# Altium project WB55_board.PrjPcb (part 2 of 3)

## Sheet MCU.SchDoc
size A4; SheetNumber: 2; SheetTotal: 3
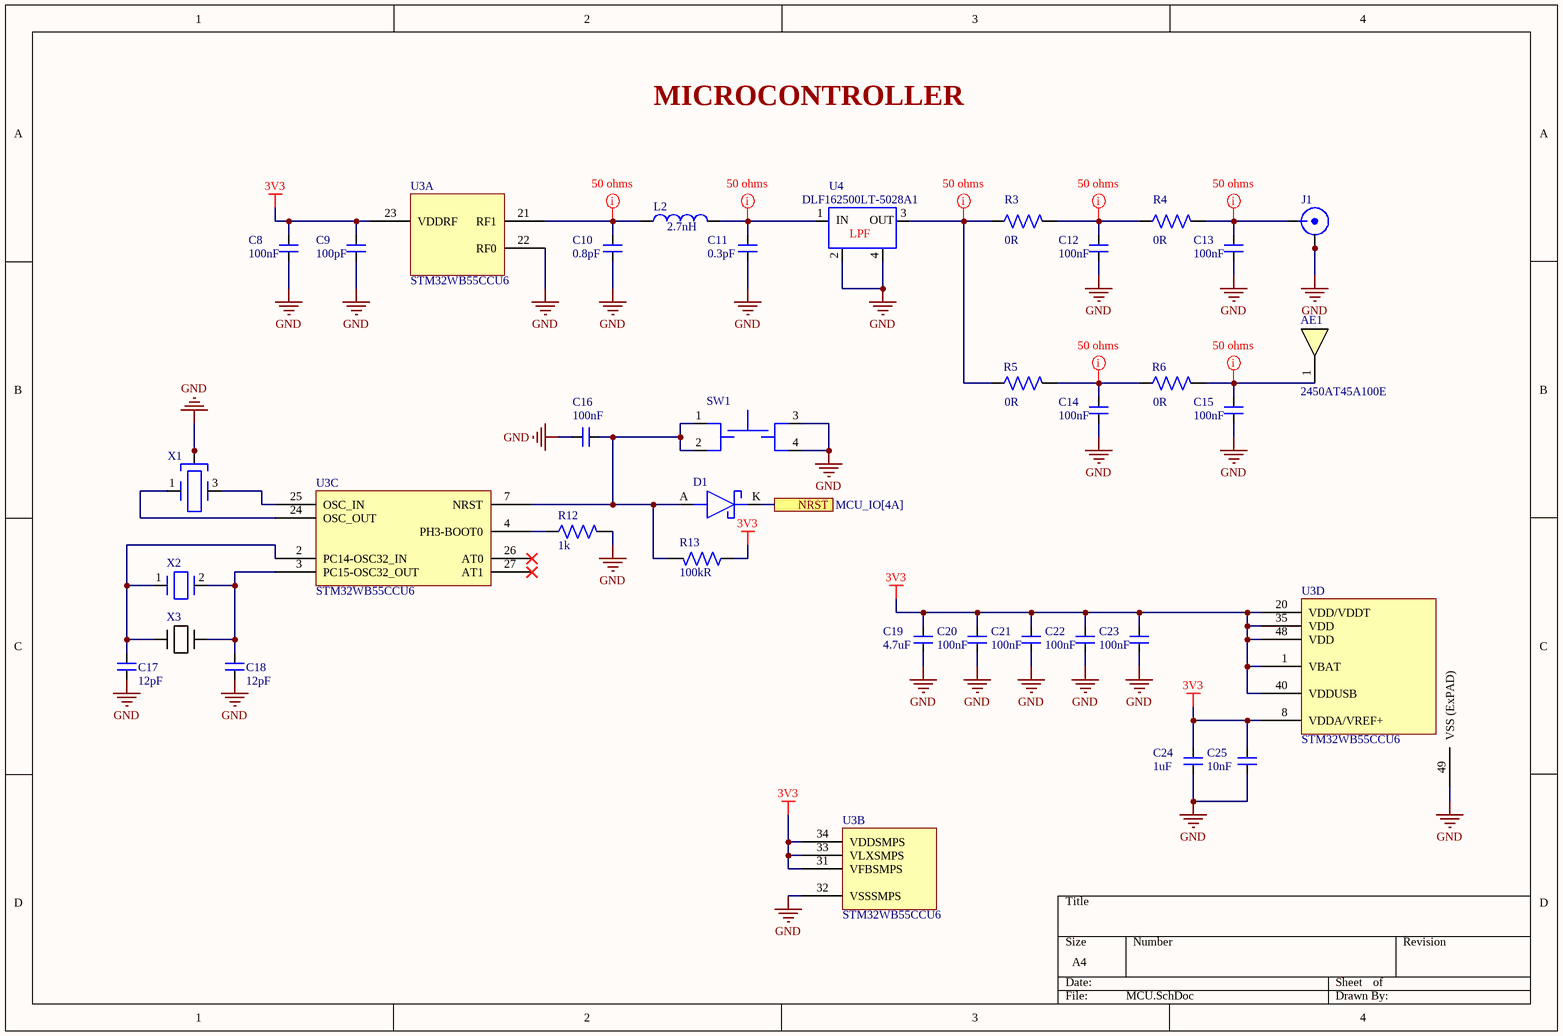
[diagram p1: MCU.SchDoc]

### Parts
AE1  2450AT45A100E  [2450AT45A100E]
C8  value 100nF  [C0402]  (hidden comment: C0402C104K4RACTU)
C9  value 100pF  [C0402]  (hidden comment: GCM1555C1H101JA16D)
C10  value 0.8pF  [C0402]  (hidden comment: GRM1555C1HR80BA01D)
C11  value 0.3pF  [C0402]  (hidden comment: GRM1555C1HR30WA01D)
C12  value 100nF  [C0402]  (hidden comment: C0402C104K4RACTU)
C13  value 100nF  [C0402]  (hidden comment: C0402C104K4RACTU)
C14  value 100nF  [C0402]  (hidden comment: C0402C104K4RACTU)
C15  value 100nF  [C0402]  (hidden comment: C0402C104K4RACTU)
C16  value 100nF  [C0402]  (hidden comment: C0402C104K4RACTU)
C17  value 12pF  [C0402]  (hidden comment: C0402C120J5GACTU)
C18  value 12pF  [C0402]  (hidden comment: C0402C120J5GACTU)
C19  value 4.7uF  [C1210]  (hidden comment: CGA6M3X7S2A475K200AB)
C20  value 100nF  [C0402]  (hidden comment: C0402C104K4RACTU)
C21  value 100nF  [C0402]  (hidden comment: C0402C104K4RACTU)
C22  value 100nF  [C0402]  (hidden comment: C0402C104K4RACTU)
C23  value 100nF  [C0402]  (hidden comment: C0402C104K4RACTU)
C24  value 1uF  [C0402]  (hidden comment: CGB2A1X6S1A105K033BC)
C25  value 10nF  [C0402]  (hidden comment: CC0402KRX7R9BB103)
D1  BAT54GWJ  [SOD123]  (value not drawn)
J1  RSP-122811-01  [U.FL-R-SMT-1(10)]  (value not drawn)
L2  LQG15HS2N7S02D  [L0402]  (value not drawn)
R3  value 0R  [R0402]  (hidden comment: RC0402JR-070RL)
R4  value 0R  [R0402]  (hidden comment: RC0402JR-070RL)
R5  value 0R  [R0402]  (hidden comment: RC0402JR-070RL)
R6  value 0R  [R0402]  (hidden comment: RC0402JR-070RL)
R12  value 1k  [R0402]  (hidden comment: RC0402FR-071KL)
R13  value 100kR  [R0402]  (hidden comment: RC0402JR-07100KL)
SW1  TS02-66-130-BK-260-LCR-D  [BUTTON]  (value not drawn)
U3  STM32WB55CCU6  [WB55]  (parts A,B,C,D of 5)
U4  DLF162500LT-5028A1  [4PIN_LPF]
X1  NX2016SA-32M-EXS00A-CS06465  [XTAL32MHZ]  (value not drawn)
X2  NX2012SA-32.768K-STD-MUB-1  [NX2012SA]  (value not drawn)
X3  ECS-.327-12.5-17X-TR  [CRI_306]  (value not drawn)

### Ports
NRST (see MCU_IO[4A])

### Nets
3V3: C8.2 C9.2 C19.2 C20.2 C21.2 C22.2 C23.2 C24.2 C25.2 R13.1 U3.1(VBAT) U3.8(VDDA/VREF+) U3.20(VDD/VDDT) U3.23(VDDRF) U3.31(VFBSMPS) U3.33(VLXSMPS) U3.34(VDDSMPS) U3.35(VDD) U3.40(VDDUSB) U3.48(VDD)
GND: C8.1 C9.1 C10.1 C11.1 C12.1 C13.1 C14.1 C15.1 C16.2 C17.1 C18.2 C19.1 C20.1 C21.1 C22.1 C23.1 C24.1 C25.1 J1.2 J1.3 R12.2 SW1.3 SW1.4 U3.22(RF0) U3.32(VSSSMPS) U3.49(VSS_(ExPAD)) U4.2 U4.4 X1.2 X1.4
NetAE1_1: AE1.1(Feeding_Point) C15.2 R6.2
NetC10_2: C10.2 L2.1 U3.21(RF1)
NetC11_2: C11.2 L2.2 U4.1
NetC12_2: C12.2 R3.2 R4.1
NetC13_2: C13.2 J1.1 R4.2
NetC14_2: C14.2 R5.2 R6.1
NetC16_1: C16.1 D1.A R13.2 SW1.1 SW1.2 U3.7(NRST)
NetC17_2: C17.2 U3.2(PC14-OSC32_IN) X2.1 X3.1
NetC18_1: C18.1 U3.3(PC15-OSC32_OUT) X2.2 X3.4
NetCN3_5: D1.K ; port NRST
NetR3_1: R3.1 R5.1 U4.3
NetR12_1: R12.1 U3.4(PH3-BOOT0)
NetU3_24: U3.24(OSC_OUT) X1.1
NetU3_25: U3.25(OSC_IN) X1.3

Not connected (* = marked no-connect by the designer): U3 26(AT0)* 27(AT1)*

### Layout directives
net class 50 ohms top/bottom: NetAE1_1, NetC10_2, NetC11_2, NetC12_2, NetC13_2, NetC14_2, NetR3_1

### Notes on the sheet
- MICROCONTROLLER
- (in symbol DLF162500LT-5028A1) IN; OUT; LPF

### Library data of the parts
AE1 = 2450AT45A100E: Antenna Ceramic 2.2dBi Gain 2500MHz 2-Pin T/R / ANTENNA CHIP 2.4GHZ; Manufacturer: Johanson; Impedance: 50R; Power Rating: 3W; Bandwidth: 100MHz; Number of Bands: 1; Return Loss: -9.5dB; Frequency: 2.45GHz; Gain: 1dB; Clock Frequency: 2.5GHz; Supplier: Newark; Supplier Part Number: 41T1678; Manufacturer Part Number: 2450AT45A100E; RoHS: Yes; Category: RF Antennas; Stock: 8; Pricing: 1=0,728, 10=0,62, 25=0,572, 50=0,523, 100=0,475 (USD); Mounting Technology: Surface Mount; Pins: 2; Min Operating Temperature: -40°C; Max Operating Temperature: 85°C; Package Quantity: 1000; Packaging: Tape and Reel; Max Power Dissipation: 3W; Termination: Solder; Series: -; Min Frequency: 2.4GHz; Input Impedance: 50R; Input Power: 3W; Length: 9.5mm; Width: 2mm; Height: 1.2mm; Radiation Hardening: No; Reach SVHC Compliant: No; RoHS Compliant: Yes; ComponentLink1URL: https://datasheet.ciiva.com/2791/jti-antenna-2450at45a100-2006-07-2791936.pdf?src-supplier=Digikey; ComponentLink1Description: https://datasheet.ciiva.com/2791/jti-antenna-2450at45a100-2006-07-2791936.pdf?src-supplier=Digikey; ComponentLink2URL: https://datasheet.ciiva.com/24068/antenna-2450at45a100-v5-242465-24068002.pdf?src-supplier=Mouser; ComponentLink2Description: https://datasheet.ciiva.com/24068/antenna-2450at45a100-v5-242465-24068002.pdf?src-supplier=Mouser; ComponentLink3URL: https://datasheet.ciiva.com/1126/1296113-1126176.pdf?src-supplier=Newark; ComponentLink3Description: https://datasheet.ciiva.com/1126/1296113-1126176.pdf?src-supplier=Newark; ComponentLink4URL: https://datasheet.ciiva.com/6748/antenna-2450at45a100-v5-6748578.pdf?src-supplier=Newark; ComponentLink4Description: https://datasheet.ciiva.com/6748/antenna-2450at45a100-v5-6748578.pdf?src-supplier=Newark; ComponentLink5URL: https://datasheet.ciiva.com/2791/jti-antenna-2450at45a100-2006-07-2791937.pdf?src-supplier=Digikey; ComponentLink5Description: https://datasheet.ciiva.com/2791/jti-antenna-2450at45a100-2006-07-2791937.pdf?src-supplier=Digikey; ComponentLink6URL: https://datasheet.ciiva.com/2791/jti-antenna-2450at45a100-2006-07-2791938.pdf?src-supplier=Digikey; ComponentLink6Description: https://datasheet.ciiva.com/2791/jti-antenna-2450at45a100-2006-07-2791938.pdf?src-supplier=Digikey; ComponentLink7URL: https://datasheet.ciiva.com/1124/1318299-1124920.pdf?src-supplier=Element14; ComponentLink7Description: https://datasheet.ciiva.com/1124/1318299-1124920.pdf?src-supplier=Element14
C8 C12-C16 C20-C23 = C0402C104K4RACTU: Multilayer Ceramic Capacitor, 0.1 uF, 16 V, ï¿½ 10%, X7R, 0402 [1005 Metric]; Manufacturer: KEMET; Voltage Rating: 16V; Supplier: Mouser; Supplier Part Number: 80-C0402C104K4R; Manufacturer Part Number: C0402C104K4RACTU; RoHS: Yes; Category: Ceramic Capacitors; Stock: 1723997; Pricing: 1=0,1, 10=0,012, 50=0,012, 100=0,009, 1000=0,008, 10000=0,006 (USD); Mounting Technology: Surface Mount; Case/Package: 0402; Pins: 2; Dielectric Material: Ceramic; Case Code (Imperial): 0402; Case Code (Metric): 1005; Material: Ceramic; Min Operating Temperature: -55°C; Max Operating Temperature: 125°C; Tolerance: 10%; Packaging: Tape and Reel; Dielectric: X7R; Series: SMD Comm X7R; Voltage: 16V; Voltage Rating (AC): 16V; Length: 1mm; Depth: 0.5mm; Lead Pitch: 300um; Thickness: 558.8um; Radiation Hardening: No; Reach SVHC Compliant: No; RoHS Compliant: Yes; Lead Free: Lead Free; ComponentLink1URL: https://datasheet.ciiva.com/45846/docfinderpartnumberc0402c102k5ractu-45846919.pdf?src-supplier=Onlinecomponents.com; ComponentLink1Description: https://datasheet.ciiva.com/45846/docfinderpartnumberc0402c102k5ractu-45846919.pdf?src-supplier=Onlinecomponents.com; ComponentLink2URL: https://datasheet.ciiva.com/18192/getdatasheetpartid-385384-18192412.pdf?src-supplier=Verical; ComponentLink2Description: https://datasheet.ciiva.com/18192/getdatasheetpartid-385384-18192412.pdf?src-supplier=Verical
C9 = GCM1555C1H101JA16D: Multilayer Ceramic Capacitor, 100 pF, 50 V, ï¿½ 5%, C0G (NP0), 0402 [1005 Metric]; Manufacturer: Murata; Voltage Rating: 50V; Temperature Coefficient: 30ppm/°C; Supplier: Mouser; Supplier Part Number: 81-GCM1555C1H101JA6D; Manufacturer Part Number: GCM1555C1H101JA16D; RoHS: Yes; Category: Ceramic Capacitors; Stock: 954968; Pricing: 1=0,1, 10=0,03, 50=0,03, 100=0,016, 1000=0,01, 10000=0,005 (USD); Mounting Technology: Surface Mount; Case/Package: 0402; Case Code (Metric): 1005; Case Code (Imperial): 0402; Weight: 0.000212oz; Material: Ceramic; Min Operating Temperature: -55°C; Max Operating Temperature: 125°C; Tolerance: 5%; Packaging: Tape and Reel; Dielectric: C0G; Voltage: 50V; Termination: SMD/SMT; Voltage Rating (DC): 50V; Package Quantity: 10000; Series: GCM; Length: 1mm; Width: 0.02inch; Height: 0.5mm; Thickness: 0.022inch; Depth: 0.5mm; Ratings: AEC-Q200; Radiation Hardening: No; Reach SVHC Compliant: No; Lead Free: Lead Free; RoHS Compliant: Yes; ComponentLink1URL: https://datasheet.ciiva.com/26889/getdatasheetpartid-748988-26889122.pdf?src-supplier=Verical; ComponentLink1Description: https://datasheet.ciiva.com/26889/getdatasheetpartid-748988-26889122.pdf?src-supplier=Verical
C10 = GRM1555C1HR80BA01D: Multilayer Ceramic Capacitor, 0.8 pF, 50 V, ï¿½ 0.1pF, C0G (NP0), 0402 [1005 Metric]; Manufacturer: Murata; Voltage Rating: 50V; Supplier: Mouser; Supplier Part Number: 81-GRM1555C1HR80BA1D; Manufacturer Part Number: GRM1555C1HR80BA01D; RoHS: Yes; Category: Ceramic Capacitors; Stock: 6504; Pricing: 1=0,1, 10=0,042, 50=0,042, 100=0,026, 1000=0,02, 2500=0,017, 10000=0,011, 50000=0,01 (USD); Mounting Technology: Surface Mount; Case/Package: 0402; Case Code (Metric): 1005; Case Code (Imperial): 0402; Material: Ceramic; Min Operating Temperature: -55°C; Max Operating Temperature: 125°C; Package Quantity: 1; Packaging: Tape and Reel; Voltage Rating (DC): 50V; Dielectric: C0G; Termination: SMD/SMT; Voltage: 50V; Series: GRM; Construction: Flat; Length: 1mm; Width: 0.5mm; Height: 0.5mm; Thickness: 0.022inch; Depth: 0.5mm; Radiation Hardening: No; Lead Free: Lead Free; RoHS Compliant: Yes; ComponentLink1URL: https://datasheet.ciiva.com/6263/grm1555c1hr75ba01-01-6263972.pdf?src-supplier=Digikey; ComponentLink1Description: https://datasheet.ciiva.com/6263/grm1555c1hr75ba01-01-6263972.pdf?src-supplier=Digikey; ComponentLink2URL: https://datasheet.ciiva.com/6263/partnumbering-e-01-6263975.pdf?src-supplier=Digikey; ComponentLink2Description: https://datasheet.ciiva.com/6263/partnumbering-e-01-6263975.pdf?src-supplier=Digikey; ComponentLink3URL: https://datasheet.ciiva.com/6263/partnumbering-e-01-6263977.pdf?src-supplier=Digikey; ComponentLink3Description: https://datasheet.ciiva.com/6263/partnumbering-e-01-6263977.pdf?src-supplier=Digikey; ComponentLink4URL: https://datasheet.ciiva.com/11616/product-11616827.pdf?src-supplier=Avnet; ComponentLink4Description: https://datasheet.ciiva.com/11616/product-11616827.pdf?src-supplier=Avnet; ComponentLink5URL: https://datasheet.ciiva.com/5436/product-5436190.pdf?src-supplier=Mouser; ComponentLink5Description: https://datasheet.ciiva.com/5436/product-5436190.pdf?src-supplier=Mouser; ComponentLink6URL: https://datasheet.ciiva.com/16495/c02e-16495271.pdf?src-supplier=Future+Electronics; ComponentLink6Description: https://datasheet.ciiva.com/16495/c02e-16495271.pdf?src-supplier=Future+Electronics
C11 = GRM1555C1HR30WA01D: Cap Ceramic 0.3pF 50V C0G 0.05pF Pad SMD 0402 125°C T/R; Manufacturer: Murata; Supplier: Mouser; Supplier Part Number: 81-GRM1555C1HR30WA1D; Manufacturer Part Number: GRM1555C1HR30WA01D; RoHS: Yes; Category: Ceramic Capacitors; Stock: 16063; Pricing: 1=0,17, 10=0,069, 50=0,069, 100=0,042, 1000=0,037, 10000=0,026 (USD); Mounting Technology: Surface Mount; Case/Package: 0402; Case Code (Metric): 1005; Case Code (Imperial): 0402; Material: Ceramic; Min Operating Temperature: -55°C; Max Operating Temperature: 125°C; Package Quantity: 1; Voltage Rating: 50V; Packaging: Tape and Reel; Voltage Rating (DC): 50V; Dielectric: C0G; Termination: SMD/SMT; Voltage: 50V; Series: GRM; Construction: Flat; Length: 1mm; Width: 0.5mm; Height: 0.5mm; Thickness: 0.022inch; Depth: 0.5mm; Radiation Hardening: No; Lead Free: Lead Free; RoHS Compliant: Yes; ComponentLink1URL: https://datasheet.ciiva.com/6264/grm1555c1hr30ba01-01-6264100.pdf?src-supplier=Digikey; ComponentLink1Description: https://datasheet.ciiva.com/6264/grm1555c1hr30ba01-01-6264100.pdf?src-supplier=Digikey; ComponentLink2URL: https://datasheet.ciiva.com/11617/product-11617602.pdf?src-supplier=Avnet; ComponentLink2Description: https://datasheet.ciiva.com/11617/product-11617602.pdf?src-supplier=Avnet; ComponentLink3URL: https://datasheet.ciiva.com/6264/partnumbering-e-01-6264101.pdf?src-supplier=Digikey; ComponentLink3Description: https://datasheet.ciiva.com/6264/partnumbering-e-01-6264101.pdf?src-supplier=Digikey; ComponentLink4URL: https://datasheet.ciiva.com/6264/partnumbering-e-01-6264102.pdf?src-supplier=Digikey; ComponentLink4Description: https://datasheet.ciiva.com/6264/partnumbering-e-01-6264102.pdf?src-supplier=Digikey
C17 C18 = C0402C120J5GACTU: Multilayer Ceramic Capacitor, 12 pF, 50 V, ï¿½ 5%, C0G (NP0), 0402 [1005 Metric]; Manufacturer: KEMET; Voltage Rating: 50V; Temperature Coefficient: 30ppm/°C; Supplier: Mouser; Supplier Part Number: 80-C0402C120J5G; Manufacturer Part Number: C0402C120J5GACTU; RoHS: Yes; Category: Ceramic Capacitors; Stock: 110567; Pricing: 1=0,1, 10=0,021, 50=0,021, 100=0,011, 1000=0,007, 10000=0,005 (USD); Mounting Technology: Surface Mount,PCB; Case/Package: 0402; Pins: 2; Case Code (Metric): 1005; Case Code (Imperial): 0402; Material: Ceramic; Min Operating Temperature: -55°C; Max Operating Temperature: 125°C; Tolerance: 5%; Voltage Rating (DC): 50V; Packaging: Tape and Reel; Package Quantity: 1; Dielectric: C0G; Termination: SMD/SMT; Series: C; Construction: Flat; Voltage Rating (AC): 50V; Length: 1mm; Width: 0.02inch; Height: 0.5mm; Thickness: 0.022inch; Lead Pitch: 0.3mm; Depth: 0.5mm; Radiation Hardening: No; Reach SVHC Compliant: No; Lead Free: Lead Free; RoHS Compliant: Yes; ComponentLink1URL: https://datasheet.ciiva.com/7392/1372242-7392447.pdf?src-supplier=Newark; ComponentLink1Description: https://datasheet.ciiva.com/7392/1372242-7392447.pdf?src-supplier=Newark; ComponentLink2URL: https://datasheet.ciiva.com/7747/kem-c1003-c0g-smd-7747451.pdf?src-supplier=Element14; ComponentLink2Description: https://datasheet.ciiva.com/7747/kem-c1003-c0g-smd-7747451.pdf?src-supplier=Element14; ComponentLink3URL: https://datasheet.ciiva.com/14600/70095383-14600717.pdf?src-supplier=Allied+Electronics; ComponentLink3Description: https://datasheet.ciiva.com/14600/70095383-14600717.pdf?src-supplier=Allied+Electronics
C19 = CGA6M3X7S2A475K200AB: Multilayer Ceramic Capacitor, 4.7 uF, 100 V, ï¿½ 10%, X7S, 1210 [3225 Metric]; Manufacturer: TDK; Material: 4241ConductorMaterial; Voltage Rating: 100V; Supplier: Digikey; Supplier Part Number: 445-7005-1-ND; Manufacturer Part Number: CGA6M3X7S2A475K200AB; RoHS: Yes; Category: Ceramic Capacitors; Stock: 44060; Pricing: 1=1,49, 10=0,94, 100=0,6472 (USD); Mounting Technology: Surface Mount; Case/Package: 1210; Case Code (Metric): 3225; Case Code (Imperial): 1210; Weight: 0.000564oz; Min Operating Temperature: -55°C; Max Operating Temperature: 125°C; Package Quantity: 1; Tolerance: 10%; Packaging: Tape and Reel; Voltage Rating (DC): 100V; Dielectric: X7S; Termination: SMD/SMT; Series: CGA; Length: 3.2mm; Width: 0.098inch; Height: 2mm; Thickness: 0.087inch; Depth: 2.5mm; Ratings: AEC-Q200; Radiation Hardening: No; Reach SVHC Compliant: No; Lead Free: Lead Free; RoHS Compliant: Yes; ComponentLink1URL: https://datasheet.ciiva.com/24216/cga6m3x7s2a475k200ab-266278-24216372.pdf?src-supplier=Mouser; ComponentLink1Description: https://datasheet.ciiva.com/24216/cga6m3x7s2a475k200ab-266278-24216372.pdf?src-supplier=Mouser; ComponentLink2URL: https://datasheet.ciiva.com/26834/getdatasheetpartid-745136-26834554.pdf?src-supplier=Verical; ComponentLink2Description: https://datasheet.ciiva.com/26834/getdatasheetpartid-745136-26834554.pdf?src-supplier=Verical; ComponentLink3URL: https://datasheet.ciiva.com/8079/1807242-8079367.pdf?src-supplier=Element14; ComponentLink3Description: https://datasheet.ciiva.com/8079/1807242-8079367.pdf?src-supplier=Element14; ComponentLink4URL: https://datasheet.ciiva.com/22725/1735406-22725662.pdf?src-supplier=Element14; ComponentLink4Description: https://datasheet.ciiva.com/22725/1735406-22725662.pdf?src-supplier=Element14; ComponentLink5URL: https://datasheet.ciiva.com/28620/1735406-28620711.pdf?src-supplier=Element14; ComponentLink5Description: https://datasheet.ciiva.com/28620/1735406-28620711.pdf?src-supplier=Element14
C24 = CGB2A1X6S1A105K033BC: Multilayer Ceramic Capacitor, 1 uF, 10 V, ± 10%, X6S, 0402 [1005 Metric]; Manufacturer: TDK; Voltage Rating: 10V; Supplier: Mouser; Supplier Part Number: 810-CGB2A1X6S1A105KC; Manufacturer Part Number: CGB2A1X6S1A105K033BC; RoHS: Yes; Category: Ceramic Capacitors; Stock: 11330; Pricing: 1=0,16, 10=0,094, 50=0,094, 100=0,057, 1000=0,041, 10000=0,028 (USD); Mounting Technology: Surface Mount; Case/Package: 0402; Case Code (Metric): 1005; Case Code (Imperial): 0402; Material: Ceramic; Min Operating Temperature: -55°C; Max Operating Temperature: 105°C; Packaging: Cut Tape; Tolerance: 10%; Series: CGB; Height: 330um; Lead Free: Lead Free; RoHS Compliant: Yes; ComponentLink1URL: https://product.tdk.com/info/en/catalog/spec/mlccspec_commercial_lowprofile_en.pdf?src-supplier=Digikey; ComponentLink1Description: https://product.tdk.com/info/en/catalog/spec/mlccspec_commercial_lowprofile_en.pdf?src-supplier=Digikey; ComponentLink2URL: http://product.tdk.com/en/catalog/datasheets/mlcc_commercial_lowprofile_en.pdf?src-supplier=Avnet; ComponentLink2Description: http://product.tdk.com/en/catalog/datasheets/mlcc_commercial_lowprofile_en.pdf?src-supplier=Avnet; ComponentLink3URL: https://datasheet.octopart.com/CGB2A1X6S1A105K033BC-TDK-datasheet-60278159.pdf?src-supplier=Future+Electronics; ComponentLink3Description: https://datasheet.octopart.com/CGB2A1X6S1A105K033BC-TDK-datasheet-60278159.pdf?src-supplier=Future+Electronics
C25 = CC0402KRX7R9BB103: Multilayer Ceramic Capacitor, 0.01 uF, 50 V, ï¿½ 10%, X7R, 0402 [1005 Metric]; Manufacturer: Yageo; Voltage Rating: 50V; Temperature Coefficient: 30ppm/°C; Supplier: Future Electronics; Supplier Part Number: 8570871; Manufacturer Part Number: CC0402KRX7R9BB103; RoHS: Yes; Category: Ceramic Capacitors; Stock: 21800000; Pricing: 10000=0,0016, 40000=0,0015, 150000=0,0015, 300000=0,0014, 750000=0,0014 (USD); Mounting Technology: Surface Mount; Case/Package: 0402; Case Code (Imperial): 0402; Case Code (Metric): 1005; Material: Ceramic; Min Operating Temperature: -55°C; Max Operating Temperature: 125°C; Tolerance: 10%; Packaging: Tape and Reel; Voltage Rating (DC): 50V; Package Quantity: 1; Dielectric: X7R; Termination: SMD/SMT; Voltage: 50V; Series: CC; Length: 1mm; Width: 0.02inch; Height: 0.5mm; Thickness: 0.022inch; Depth: 0.5mm; Radiation Hardening: No; Reach SVHC Compliant: No; Lead Free: Lead Free; RoHS Compliant: Yes; Halogen Free: 5694HalogenFree; ComponentLink1URL: https://datasheet.ciiva.com/11788/0900766b8079c870-11788375.pdf?src-supplier=Rs; ComponentLink1Description: https://datasheet.ciiva.com/11788/0900766b8079c870-11788375.pdf?src-supplier=Rs; ComponentLink2URL: https://datasheet.ciiva.com/26862/getdatasheetpartid-138248-26862642.pdf?src-supplier=Verical; ComponentLink2Description: https://datasheet.ciiva.com/26862/getdatasheetpartid-138248-26862642.pdf?src-supplier=Verical; ComponentLink3URL: https://datasheet.ciiva.com/176/mlccorderingcode-176349.pdf?src-supplier=Digikey; ComponentLink3Description: https://datasheet.ciiva.com/176/mlccorderingcode-176349.pdf?src-supplier=Digikey; ComponentLink4URL: https://datasheet.ciiva.com/176/mlccorderingcode-176350.pdf?src-supplier=Digikey; ComponentLink4Description: https://datasheet.ciiva.com/176/mlccorderingcode-176350.pdf?src-supplier=Digikey; ComponentLink5URL: https://datasheet.ciiva.com/176/mlccorderingcode-176348.pdf?src-supplier=Digikey; ComponentLink5Description: https://datasheet.ciiva.com/176/mlccorderingcode-176348.pdf?src-supplier=Digikey; ComponentLink6URL: https://datasheet.ciiva.com/7978/1489800-7978093.pdf?src-supplier=Element14; ComponentLink6Description: https://datasheet.ciiva.com/7978/1489800-7978093.pdf?src-supplier=Element14; ComponentLink7URL: https://datasheet.ciiva.com/28450/1489800-28450377.pdf?src-supplier=Element14; ComponentLink7Description: https://datasheet.ciiva.com/28450/1489800-28450377.pdf?src-supplier=Element14
D1 = BAT54GWJ: Schottky Diode, Sngl, 30V, 0.2A, Sod-123 Rohs Compliant: Yes |Nexperia BAT54GWJ; Supplier: Mouser; Supplier Part Number: 841-BAT54GWJ; Manufacturer: Nexperia; Manufacturer Part Number: BAT54GWJ; RoHS: Yes; Category: Schottky Diodes; Stock: 282728; Pricing: 1=0,1, 10=0,069, 50=0,069, 100=0,036, 1000=0,029, 10000=0,022 (USD); RoHS Compliant: Yes; ComponentLink1URL: https://datasheet.octopart.com/BAT54GWJ-Nexperia-datasheet-82522515.pdf?src-supplier=Future+Electronics; ComponentLink1Description: https://datasheet.octopart.com/BAT54GWJ-Nexperia-datasheet-82522515.pdf?src-supplier=Future+Electronics
J1 = RSP-122811-01: RF MHF Connector, 1 Contact(s), Male, Board Mount, Surface Mount Terminal, Receptacle; Manufacturer: Samtec; Body Material: Bronze; Dielectric Material: Polymer; Impedance: 50R; Gender: Female; Connector Type: Receptacle,Male Pin; Operating Frequency: 0 to 6 GHz; Clock Frequency: 6GHz; Number of Ports: 1; Number of Contacts: 1NUMBER; Voltage Rating: 60V; Supplier: Digikey; Supplier Part Number: 612-RSP-122811-01CT-ND; Manufacturer Part Number: RSP-122811-01; RoHS: Yes; Category: RF / Coaxial Connectors; Stock: 8691; Pricing: 1=1,1, 10=0,936, 25=0,8772, 50=0,8352, 100=0,7952, 250=0,7454, 500=0,70978, 1000=0,67589, 2500=0,6426 (USD); Mounting Technology: Surface Mount; Case/Package: SMD/SMT; Contact Material: Bronze; Min Operating Temperature: -40°C; Max Operating Temperature: 90°C; Packaging: Strip; Termination: Solder; Orientation: Straight; Fastening Type: SNAP-ON; Series: -; Length: 3.1mm; Depth: 3mm; Radiation Hardening: No; RoHS Compliant: Yes; ComponentLink1URL: https://media.digikey.com/pdf/Data%20Sheets/Samtec/RSP-122811-01_dwg.pdf?src-supplier=Digikey; ComponentLink1Description: https://media.digikey.com/pdf/Data%20Sheets/Samtec/RSP-122811-01_dwg.pdf?src-supplier=Digikey; ComponentLink2URL: http://components.arrow.com/part/dataview/44251978S9204898N1004?src-supplier=Arrow+Electronics; ComponentLink2Description: http://components.arrow.com/part/dataview/44251978S9204898N1004?src-supplier=Arrow+Electronics; ComponentLink3URL: http://www.samtec.com/documents/webfiles/CPDF/rsp-122811-02.pdf?src-supplier=Avnet; ComponentLink3Description: http://www.samtec.com/documents/webfiles/CPDF/rsp-122811-02.pdf?src-supplier=Avnet
L2 = LQG15HS2N7S02D: Inductor RF Chip Multi-Layer 2.7nH 0.3nH 100MHz 8Q-Factor Air 300mA 150mOhm DCR 0402 T/R; Manufacturer: Murata; Q Factor: 8; Self Resonant Frequency: 6GHz; Shielding: Unshielded; DC Resistance (DCR): 150mR; RMS Current (Irms): 800mA; ESR: 120mR; Supplier: Mouser; Supplier Part Number: 81-LQG15HS2N7S02D; Manufacturer Part Number: LQG15HS2N7S02D; RoHS: Yes; Category: Fixed Inductors; Stock: 7929; Pricing: 1=0,1, 10=0,037, 50=0,037, 100=0,029, 1000=0,025, 10000=0,018 (USD); Mounting Technology: Surface Mount; Case/Package: 0402; Core Material: Air; Case Code (Metric): 1005; Case Code (Imperial): 0402; Min Operating Temperature: -55°C; Max Operating Temperature: 125°C; Packaging: Tape and Reel; Package Quantity: 1; Current Rating: 300mA; Termination: SMD/SMT; Series: LQG15HS; Value: 2.7nH; Max DC Current: 300mA; Test Frequency: 100MHz; DC Current: 300mA; Max Current Rating: 300mA; Length: 1mm; Width: 0.02inch; Height: 0.5mm; Depth: 0.55mm; Height - Seated (Max): 0.022inch; Radiation Hardening: No; RoHS Compliant: Yes; Military Standard: Not; Lead Free: Lead Free; ComponentLink1URL: https://datasheet.ciiva.com/11801/0900766b8090d685-11801391.pdf?src-supplier=Rs; ComponentLink1Description: https://datasheet.ciiva.com/11801/0900766b8090d685-11801391.pdf?src-supplier=Rs; ComponentLink2URL: https://datasheet.ciiva.com/1038/l0075s0083lqg15hs-1038151.pdf?src-supplier=Digikey; ComponentLink2Description: https://datasheet.ciiva.com/1038/l0075s0083lqg15hs-1038151.pdf?src-supplier=Digikey; ComponentLink3URL: https://datasheet.ciiva.com/1038/l0075s0083lqg15hs-1038152.pdf?src-supplier=Digikey; ComponentLink3Description: https://datasheet.ciiva.com/1038/l0075s0083lqg15hs-1038152.pdf?src-supplier=Digikey; ComponentLink4URL: https://datasheet.ciiva.com/1038/l0075s0083lqg15hs-1038153.pdf?src-supplier=Digikey; ComponentLink4Description: https://datasheet.ciiva.com/1038/l0075s0083lqg15hs-1038153.pdf?src-supplier=Digikey; ComponentLink5URL: https://datasheet.ciiva.com/8510/l0075s0083lqg15hs-8510853.pdf?src-supplier=Avnet; ComponentLink5Description: https://datasheet.ciiva.com/8510/l0075s0083lqg15hs-8510853.pdf?src-supplier=Avnet
R3-R6 = RC0402JR-070RL: GENERAL PURPOSE CHIP RESISTOR Metal Glaze/thick Film, 0.0625W, 0ohm, Surface Mount, 0402; Manufacturer: Yageo; Power Rating: 62.5mW; Tolerance: 5%; Voltage Rating: 50V; Max Power Dissipation: 63mW; Temperature Coefficient: 200ppm/°C; Supplier: Future Electronics; Supplier Part Number: 3375797; Manufacturer Part Number: RC0402JR-070RL; RoHS: Yes; Category: Chip SMD Resistors; Stock: 45190000; Pricing: 10000=0,0007, 50000=0,0007, 200000=0,0007, 500000=0,0006, 1250000=0,0006 (USD); Case/Package: 0402; Contact Plating: Tin,Matte; Case Code (Metric): 1005; Case Code (Imperial): 0402; Min Operating Temperature: -55°C; Max Operating Temperature: 155°C; Package Quantity: 1; Packaging: Tape and Reel; Resistor Type: Thick Film; Number of Terminations: 2; Termination: SMD/SMT; Features: Moisture Resistant; Series: RC; Technology: THICK FILM; Resistance Tolerance: 5%; Construction: Rectangular; Length: 1mm; Width: 0.02inch; Height: 0.016inch; Depth: 0.5mm; Lead Free: Lead Free; Reach SVHC Compliant: Unknown; Military Standard: Not; RoHS Compliant: Yes; ComponentLink1URL: https://datasheet.ciiva.com/2452/pyu-rc0402-51-rohs-l-6-2452608.pdf?src-supplier=Digikey; ComponentLink1Description: https://datasheet.ciiva.com/2452/pyu-rc0402-51-rohs-l-6-2452608.pdf?src-supplier=Digikey; ComponentLink2URL: https://datasheet.ciiva.com/11808/0900766b80c66297-11808195.pdf?src-supplier=Rs; ComponentLink2Description: https://datasheet.ciiva.com/11808/0900766b80c66297-11808195.pdf?src-supplier=Rs; ComponentLink3URL: https://datasheet.ciiva.com/2452/pyu-r-int-thick-7-2452609.pdf?src-supplier=Digikey; ComponentLink3Description: https://datasheet.ciiva.com/2452/pyu-r-int-thick-7-2452609.pdf?src-supplier=Digikey; ComponentLink4URL: https://datasheet.ciiva.com/2452/pyu-r-int-thick-7-2452610.pdf?src-supplier=Digikey; ComponentLink4Description: https://datasheet.ciiva.com/2452/pyu-r-int-thick-7-2452610.pdf?src-supplier=Digikey; ComponentLink5URL: https://datasheet.ciiva.com/8896/pyu-rc0402-51-rohs-l-6-8896201.pdf?src-supplier=Avnet; ComponentLink5Description: https://datasheet.ciiva.com/8896/pyu-rc0402-51-rohs-l-6-8896201.pdf?src-supplier=Avnet; ComponentLink6URL: https://datasheet.ciiva.com/15189/getdatasheetpartid-326379-15189533.pdf?src-supplier=Verical; ComponentLink6Description: https://datasheet.ciiva.com/15189/getdatasheetpartid-326379-15189533.pdf?src-supplier=Verical; ComponentLink7URL: https://datasheet.ciiva.com/7983/1018594-7983535.pdf?src-supplier=Element14; ComponentLink7Description: https://datasheet.ciiva.com/7983/1018594-7983535.pdf?src-supplier=Element14; ComponentLink8URL: https://datasheet.ciiva.com/22747/1018594-22747515.pdf?src-supplier=Element14; ComponentLink8Description: https://datasheet.ciiva.com/22747/1018594-22747515.pdf?src-supplier=Element14
R12 = RC0402FR-071KL: SMD Chip Resistor 1 Kohm ½ 1% 62.5 Mw 0402 [1005 Metric] Thick Film General Purpose; Manufacturer: Yageo; Voltage Rating (DC): 50V; Temperature Coefficient: 100ppm/°C; Power Rating: 62.5mW; Max Power Dissipation: 63mW; Supplier: Avnet; Supplier Part Number: RC0402FR-071KL; Manufacturer Part Number: RC0402FR-071KL; RoHS: Yes; Category: Chip SMD Resistors; Stock: 9660000; Pricing: 10000=0,00097, 20000=0,00093, 40000=0,0009, 60000=0,00087, 80000=0,00084 (USD); Case/Package: 0402; Pins: 2; Case Code (Imperial): 0402; Case Code (Metric): 1005; Min Operating Temperature: -55°C; Max Operating Temperature: 155°C; Tolerance: 1%; Packaging: Tape and Reel; Voltage Rating: 50V; Termination: SMD/SMT; Voltage Rating (AC): 50V; Resistor Type: Thick Film; Features: Moisture Resistant; Series: RC; Number of Terminations: 2; Resistance Tolerance: 1%; Construction: Rectangular; Technology: THICK FILM; Length: 1mm; Width: 0.5mm; Height: 0.32mm; Depth: 0.5mm; Reach SVHC Compliant: No; Lead Free: Lead Free; Military Standard: Not; RoHS Compliant: Yes; ComponentLink1URL: https://datasheet.ciiva.com/11819/0900766b80c66297-11819477.pdf?src-supplier=Rs; ComponentLink1Description: https://datasheet.ciiva.com/11819/0900766b80c66297-11819477.pdf?src-supplier=Rs; ComponentLink2URL: https://datasheet.ciiva.com/7983/1018594-7983502.pdf?src-supplier=Element14; ComponentLink2Description: https://datasheet.ciiva.com/7983/1018594-7983502.pdf?src-supplier=Element14; ComponentLink3URL: https://datasheet.ciiva.com/22747/1018594-22747513.pdf?src-supplier=Element14; ComponentLink3Description: https://datasheet.ciiva.com/22747/1018594-22747513.pdf?src-supplier=Element14; ComponentLink4URL: https://datasheet.ciiva.com/17063/pyu-rc0402-51-rohs-l-6-r-17063193.pdf?src-supplier=Future+Electronics; ComponentLink4Description: https://datasheet.ciiva.com/17063/pyu-rc0402-51-rohs-l-6-r-17063193.pdf?src-supplier=Future+Electronics; ComponentLink5URL: https://datasheet.ciiva.com/7849/1018594-7849869.pdf?src-supplier=Element14; ComponentLink5Description: https://datasheet.ciiva.com/7849/1018594-7849869.pdf?src-supplier=Element14; ComponentLink6URL: https://datasheet.ciiva.com/7849/1018594-7849871.pdf?src-supplier=Element14; ComponentLink6Description: https://datasheet.ciiva.com/7849/1018594-7849871.pdf?src-supplier=Element14; ComponentLink7URL: https://datasheet.ciiva.com/12666/pyu-rc0402-51-rohs-l-6-r-12666741.pdf?src-supplier=Mouser; ComponentLink7Description: https://datasheet.ciiva.com/12666/pyu-rc0402-51-rohs-l-6-r-12666741.pdf?src-supplier=Mouser
R13 = RC0402JR-07100KL: SMD Chip Resistor, 100 Kohm, ½ 5%, 62.5 Mw, 0402 [1005 Metric], Thick Film, General Purpose; Manufacturer: Yageo; Voltage Rating: 50V; Power Rating: 62.5mW; Temperature Coefficient: 100ppm/°C; Max Power Dissipation: 63mW; Supplier: Future Electronics; Supplier Part Number: 4246625; Manufacturer Part Number: RC0402JR-07100KL; RoHS: Yes; Category: Chip SMD Resistors; Stock: 7850000; Pricing: 10000=0,0006, 50000=0,0006, 250000=0,0005, 500000=0,0005, 1500000=0,0005 (USD); Case/Package: 0402; Case Code (Metric): 1005; Case Code (Imperial): 0402; Min Operating Temperature: -55°C; Max Operating Temperature: 155°C; Packaging: Tape and Reel; Termination: SMD/SMT; Voltage Rating (AC): 50V; Tolerance: 5%; Resistor Type: Thick Film; Number of Terminations: 2; Features: Moisture Resistant; Series: RC; Resistance Tolerance: 5%; Construction: Rectangular; Length: 1mm; Depth: 0.5mm; Lead Free: Lead Free; Reach SVHC Compliant: Unknown; Military Standard: Not; RoHS Compliant: Yes; ComponentLink1URL: https://datasheet.ciiva.com/2491/pyu-r-int-thick-7-2491208.pdf?src-supplier=Digikey; ComponentLink1Description: https://datasheet.ciiva.com/2491/pyu-r-int-thick-7-2491208.pdf?src-supplier=Digikey; ComponentLink2URL: https://datasheet.ciiva.com/2491/pyu-r-int-thick-7-2491209.pdf?src-supplier=Digikey; ComponentLink2Description: https://datasheet.ciiva.com/2491/pyu-r-int-thick-7-2491209.pdf?src-supplier=Digikey; ComponentLink3URL: https://datasheet.ciiva.com/2491/pyu-r-int-thick-7-2491207.pdf?src-supplier=Digikey; ComponentLink3Description: https://datasheet.ciiva.com/2491/pyu-r-int-thick-7-2491207.pdf?src-supplier=Digikey; ComponentLink4URL: https://datasheet.ciiva.com/17052/pyu-rc0402-51-rohs-l-6-r-17052137.pdf?src-supplier=Future+Electronics; ComponentLink4Description: https://datasheet.ciiva.com/17052/pyu-rc0402-51-rohs-l-6-r-17052137.pdf?src-supplier=Future+Electronics; ComponentLink5URL: https://datasheet.ciiva.com/46394/1018594-46394941.pdf?src-supplier=Element14; ComponentLink5Description: https://datasheet.ciiva.com/46394/1018594-46394941.pdf?src-supplier=Element14; ComponentLink6URL: https://datasheet.ciiva.com/7850/1018594-7850133.pdf?src-supplier=Element14; ComponentLink6Description: https://datasheet.ciiva.com/7850/1018594-7850133.pdf?src-supplier=Element14; ComponentLink7URL: https://datasheet.ciiva.com/12668/pyu-rc0402-51-rohs-l-6-r-12668218.pdf?src-supplier=Mouser; ComponentLink7Description: https://datasheet.ciiva.com/12668/pyu-rc0402-51-rohs-l-6-r-12668218.pdf?src-supplier=Mouser
SW1 = TS02-66-130-BK-260-LCR-D: Manufacturer: Same Sky; Category: Tactile Switches; Manufacturer Part Number: TS02-66-130-BK-260-LCR-D
U3 = STM32WB55CCU6: MCU 32-Bit STM32WB55 ARM Cortex-M4F RISC 256KB Flash 1.71V to 3.6V 48-Pin UFQFPN T/R; Manufacturer: STMicroelectronics; Interface: I2C,SPI,USB,UART,USART; Frequency: 2.48GHz; Data Rate: 2Mbps; Sensitivity: -100dBm; Current - Receiving: 7.9mA; Current - Transmitting: 12.7mA; Number of GPIO: 30; Supplier: Digikey; Supplier Part Number: 497-STM32WB55CCU6-ND; RoHS: Yes; Category: Microcontrollers; Stock: 2269; Pricing: 1=5,19, 10=3,989, 25=3,6896, 80=3,41638 (USD); Mounting Technology: Surface Mount; Case/Package: UFQFPN; Min Operating Temperature: -40°C; Max Operating Temperature: 105°C; Series: -; Memory Size: 256KB; ComponentLink1URL: https://www.st.com/resource/en/datasheet/stm32wb55cc.pdf?src-supplier=Digikey; ComponentLink1Description: https://www.st.com/resource/en/datasheet/stm32wb55cc.pdf?src-supplier=Digikey; Manufacturer Part Number: STM32WB55CCU6
U4 = DLF162500LT-5028A1: FILTER, LOW PASS, 2.4GHz to 2.5GHz; Filter Type: Low Pass; Pass Band Frequency: 2.; Manufacturer: TDK; Frequency: 2.45GHz; Insertion Loss: 0.33dB; Supplier: Digikey; Supplier Part Number: 445-15658-1-ND; Manufacturer Part Number: DLF162500LT-5028A1; RoHS: Yes; Stock: 8661; Pricing: 1=0,48, 10=0,39, 25=0,3596, 50=0,3382, 100=0,318, 250=0,29324, 500=0,2758, 1000=0,25939 (USD); Mounting Technology: Surface Mount; Case/Package: 0603; Pins: 4; Case Code (Metric): 1608; Case Code (Imperial): 0603; Min Operating Temperature: -40°C; Max Operating Temperature: 85°C; Packaging: Tape and Reel; Package Quantity: 4000; Termination: SMD/SMT; Series: DLF; Radiation Hardening: No; RoHS Compliant: Yes; ComponentLink1URL: https://datasheet.ciiva.com/24123/dlf162500lt-5028a1-279920-24123794.pdf?src-supplier=Mouser; ComponentLink1Description: https://datasheet.ciiva.com/24123/dlf162500lt-5028a1-279920-24123794.pdf?src-supplier=Mouser; ComponentLink2URL: https://datasheet.ciiva.com/23909/1751212-23909058.pdf?src-supplier=Newark; ComponentLink2Description: https://datasheet.ciiva.com/23909/1751212-23909058.pdf?src-supplier=Newark; ComponentLink3URL: https://datasheet.ciiva.com/30018/rf-lpf-dlf162500lt-5028a1-en-30018074.pdf?src-supplier=Avnet; ComponentLink3Description: https://datasheet.ciiva.com/30018/rf-lpf-dlf162500lt-5028a1-en-30018074.pdf?src-supplier=Avnet
X1 = NX2016SA-32M-EXS00A-CS06465: Crystal 32.0000MHZ 10PF SMD; Manufacturer: NDK; Frequency: 32MHz; ESR (Equivalent Series Resistance): 60R; Supplier: Mouser; Supplier Part Number: 344-NX2016SA32S06465; Manufacturer Part Number: NX2016SA-32M-EXS00A-CS06465; RoHS: No; Category: Crystals; Stock: 30578; Pricing: 1=0,56, 10=0,438, 50=0,438, 100=0,411, 1000=0,349, 10000=0,283 (USD); Mounting Technology: Surface Mount; Case/Package: SMD/SMT; Packaging: Cut Tape; Load Capacitance: 10pF; Series: NX2016SA; ComponentLink1URL: https://media.digikey.com/pdf/Data%20Sheets/NDK%20PDFs/NX2016SA-32M-EXS00A-CS06465_SS.pdf?src-supplier=Digikey; ComponentLink1Description: https://media.digikey.com/pdf/Data%20Sheets/NDK%20PDFs/NX2016SA-32M-EXS00A-CS06465_SS.pdf?src-supplier=Digikey
X2 = NX2012SA-32.768K-STD-MUB-1: Parallel - Fundamental Quartz Crystal, 0.032768MHz Nom; Manufacturer: NDK; Frequency: 32.768kHz; Load Capacitance: 12.5pF; ESR (Equivalent Series Resistance): 80kR; Frequency Tolerance: 20ppm; Tolerance: 0.002%; Supplier: Mouser; Supplier Part Number: 344-NX2012SA32768K1; Manufacturer Part Number: NX2012SA-32.768K-STD-MUB-1; RoHS: Yes; Category: Crystals; Stock: 8641; Pricing: 1=0,84, 10=0,659, 50=0,659, 100=0,6, 1000=0,5, 10000=0,414 (USD); Mounting Technology: Surface Mount; Case/Package: SMD/SMT; Min Operating Temperature: -40°C; Max Operating Temperature: 85°C; Packaging: Cut Tape; Series: NX2012SA; Length: 0.081inch; Width: 0.047inch; Height: 0.024inch; RoHS Compliant: Yes; ComponentLink1URL: http://www.ndk.com/images/products/catalog/c_NX2012SA-STD-MUB-1_e.pdf?src-supplier=Digikey; ComponentLink1Description: http://www.ndk.com/images/products/catalog/c_NX2012SA-STD-MUB-1_e.pdf?src-supplier=Digikey
X3 = ECS-.327-12.5-17X-TR: Crystal 0.032768MHz ±20ppm (Tol) 12.5pF FUND 50000Ohm 4-Pin SMD T/R; Manufacturer: ECS International; Frequency: 32.768kHz; ESR (Equivalent Series Resistance): 50kR; Supplier: Digikey; Supplier Part Number: XC1195CT-ND; Manufacturer Part Number: ECS-.327-12.5-17X-TR; RoHS: Yes; Category: Crystals; Stock: 164259; Pricing: 1=0,61, 10=0,53, 50=0,4808, 100=0,461, 500=0,41788, 1000=0,40059 (USD); Mounting Technology: Surface Mount; Min Operating Temperature: -40°C; Max Operating Temperature: 85°C; Package Quantity: 3000; Frequency Tolerance: 20ppm; Load Capacitance: 12.5pF; Packaging: Tape and Reel; Tolerance: 20ppm; Termination: SMD/SMT; Series: ECX-306X; Length: 8mm; Width: 3.8mm; Height: 2.5mm; Lead Free: Lead Free; RoHS Compliant: Yes; ComponentLink1URL: https://datasheet.ciiva.com/852/ecx-306x-852775.pdf?src-supplier=Digikey; ComponentLink1Description: https://datasheet.ciiva.com/852/ecx-306x-852775.pdf?src-supplier=Digikey; ComponentLink2URL: https://datasheet.ciiva.com/852/ecx-306x-852776.pdf?src-supplier=Digikey; ComponentLink2Description: https://datasheet.ciiva.com/852/ecx-306x-852776.pdf?src-supplier=Digikey; ComponentLink3URL: https://datasheet.ciiva.com/852/ecx-306x-852777.pdf?src-supplier=Digikey; ComponentLink3Description: https://datasheet.ciiva.com/852/ecx-306x-852777.pdf?src-supplier=Digikey